# Altium schematic sheet eps_pv.SchDoc
size A4
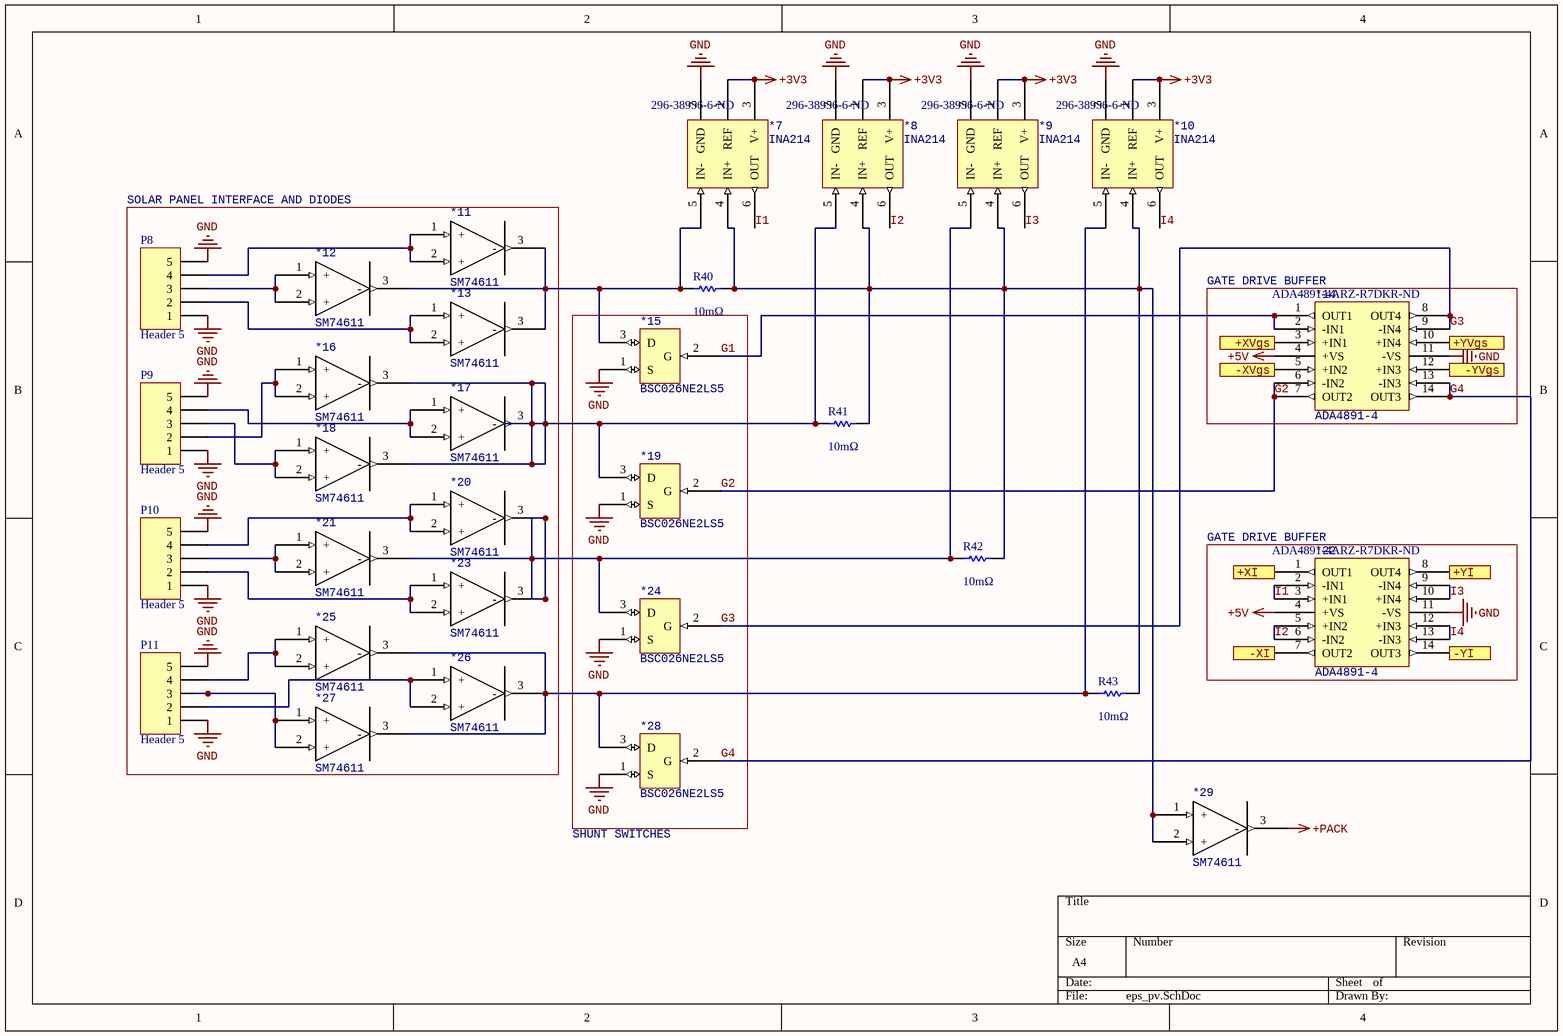
[diagram p0: eps_pv.SchDoc]

## Parts
*7  INA214  Supplier Part Number 1: 296-38956-6-ND  [SOT65P210X110-6N]
*8  INA214  Supplier Part Number 1: 296-38956-6-ND  [SOT65P210X110-6N]
*9  INA214  Supplier Part Number 1: 296-38956-6-ND  [SOT65P210X110-6N]
*10  INA214  Supplier Part Number 1: 296-38956-6-ND  [SOT65P210X110-6N]
*11  SM74611  [TO254P1435X464-3N]
*12  SM74611  [TO254P1435X464-3N]
*13  SM74611  [TO254P1435X464-3N]
*14  ADA4891-4  Supplier Part Number 1: ADA4891-4ARZ-R7DKR-ND  [R_14]
*15  BSC026NE2LS5  [INF-PG-TDSON-8-1_V]
*16  SM74611  [TO254P1435X464-3N]
*17  SM74611  [TO254P1435X464-3N]
*18  SM74611  [TO254P1435X464-3N]
*19  BSC026NE2LS5  [INF-PG-TDSON-8-1_V]
*20  SM74611  [TO254P1435X464-3N]
*21  SM74611  [TO254P1435X464-3N]
*22  ADA4891-4  Supplier Part Number 1: ADA4891-4ARZ-R7DKR-ND  [R_14]
*23  SM74611  [TO254P1435X464-3N]
*24  BSC026NE2LS5  [INF-PG-TDSON-8-1_V]
*25  SM74611  [TO254P1435X464-3N]
*26  SM74611  [TO254P1435X464-3N]
*27  SM74611  [TO254P1435X464-3N]
*28  BSC026NE2LS5  [INF-PG-TDSON-8-1_V]
*29  SM74611  [TO254P1435X464-3N]
P8  Header 5  [DF14-4P-1.25H(55) - duplicate]
P9  Header 5  [DF14-4P-1.25H(55) - duplicate]
P10  Header 5  [DF14-4P-1.25H(55) - duplicate]
P11  Header 5  [DF14-4P-1.25H(55) - duplicate]
R40  value 10mΩ  [1608[0603]]  (hidden comment: Res1)
R41  value 10mΩ  [1608[0603]]  (hidden comment: Res1)
R42  value 10mΩ  [1608[0603]]  (hidden comment: Res1)
R43  value 10mΩ  [1608[0603]]  (hidden comment: Res1)

## Blocks framed on the sheet
SOLAR PANEL INTERFACE AND DIODES: *11-*13 *16-*18 *20 *21 *23 *25-*27 P8-P11
GATE DRIVE BUFFER: *14
GATE DRIVE BUFFER: *22

## Ports
+XI (out), +XVgs (in), +YI (out), +YVgs (in), -XI (out), -XVgs (in), -YI (out), -YVgs (in)

## Nets
+3V3: *7.1(REF) *7.3(V+) *8.1(REF) *8.3(V+) *9.1(REF) *9.3(V+) *10.1(REF) *10.3(V+)
+5V: *14.4(+VS) *22.4(+VS)
+PACK: *29.3(-)
GND: *7.2(GND) *8.2(GND) *9.2(GND) *10.2(GND) *14.11(-VS) *15.1(S) *19.1(S) *22.11(-VS) *24.1(S) *28.1(S) P8.1 P8.5 P9.1 P9.5 P10.1 P10.5 P11.1 P11.5
+XI: *22.1(OUT1) ; port +XI
+XVgs: *14.3(+IN1) ; port +XVgs
+YI: *22.8(OUT4) ; port +YI
+YVgs: *14.10(+IN4) ; port +YVgs
-XI: *22.7(OUT2) ; port -XI
-XVgs: *14.5(+IN2) ; port -XVgs
-YI: *22.14(OUT3) ; port -YI
-YVgs: *14.12(+IN3) ; port -YVgs
G1: *14.1(OUT1) *14.2(-IN1) *15.2(G)
G2: *14.6(-IN2) *14.7(OUT2) *19.2(G)
G3: *14.8(OUT4) *14.9(-IN4) *24.2(G)
G4: *14.13(-IN3) *14.14(OUT3) *28.2(G)
I1: *7.6(OUT) *22.2(-IN1) *22.3(+IN1)
I2: *8.6(OUT) *22.5(+IN2) *22.6(-IN2)
I3: *9.6(OUT) *22.9(-IN4) *22.10(+IN4)
I4: *10.6(OUT) *22.12(+IN3) *22.13(-IN3)
Net*7_4: *7.4(IN+) *8.4(IN+) *9.4(IN+) *10.4(IN+) *29.1(+) *29.2(+) R40.2 R41.2 R42.2 R43.2
Net*7_5: *7.5(IN-) *11.3(-) *12.3(-) *13.3(-) *15.3(D) R40.1
Net*8_5: *8.5(IN-) *16.3(-) *17.3(-) *18.3(-) *19.3(D) R41.1
Net*9_5: *9.5(IN-) *20.3(-) *21.3(-) *23.3(-) *24.3(D) R42.1
Net*10_5: *10.5(IN-) *25.3(-) *26.3(-) *27.3(-) *28.3(D) R43.1
Net*11_1: *11.1(+) *11.2(+) P8.4
Net*12_1: *12.1(+) *12.2(+) P8.3
Net*13_1: *13.1(+) *13.2(+) P8.2
Net*16_1: *16.1(+) *16.2(+) P9.2
Net*17_1: *17.1(+) *17.2(+) P9.4
Net*18_1: *18.1(+) *18.2(+) P9.3
Net*20_1: *20.1(+) *20.2(+) P10.4
Net*21_1: *21.1(+) *21.2(+) P10.3
Net*23_1: *23.1(+) *23.2(+) P10.2
Net*25_1: *25.1(+) *25.2(+) P11.4
Net*26_1: *26.1(+) *26.2(+) P11.2
Net*27_1: *27.1(+) *27.2(+) P11.3

## Notes on the sheet
- SHUNT SWITCHES

## Library data of the parts
*7-*10 = INA214: Current monitor; Supplier 1: Digi-Key
*11-*13 *16-*18 *20 *21 *23 *25-*27 *29 = SM74611: PV Diode
*14 *22 = ADA4891-4: Op-amps; Supplier 1: Digi-Key
*15 *19 *24 *28 = BSC026NE2LS5: MOSFET
P8-P11 = Header 5: Header, 5-Pin; LatestRevisionDate: 17-Jul-2002; LatestRevisionNote: Re-released for DXP Platform.; Publisher: Altium Limited
R40-R43 = Res1: Resistor; Published: 8-Jun-2000; LatestRevisionDate: 17-Jul-2002; LatestRevisionNote: Re-released for DXP Platform.; PackageReference: AXIAL-0.3; Publisher: Altium Limited; PackageDescription: Axial Device, Thru-Hole; 2 Leads; 0.3 in Pin Spacing